# EAGLE design mouse_shield (EAGLE 5.11)
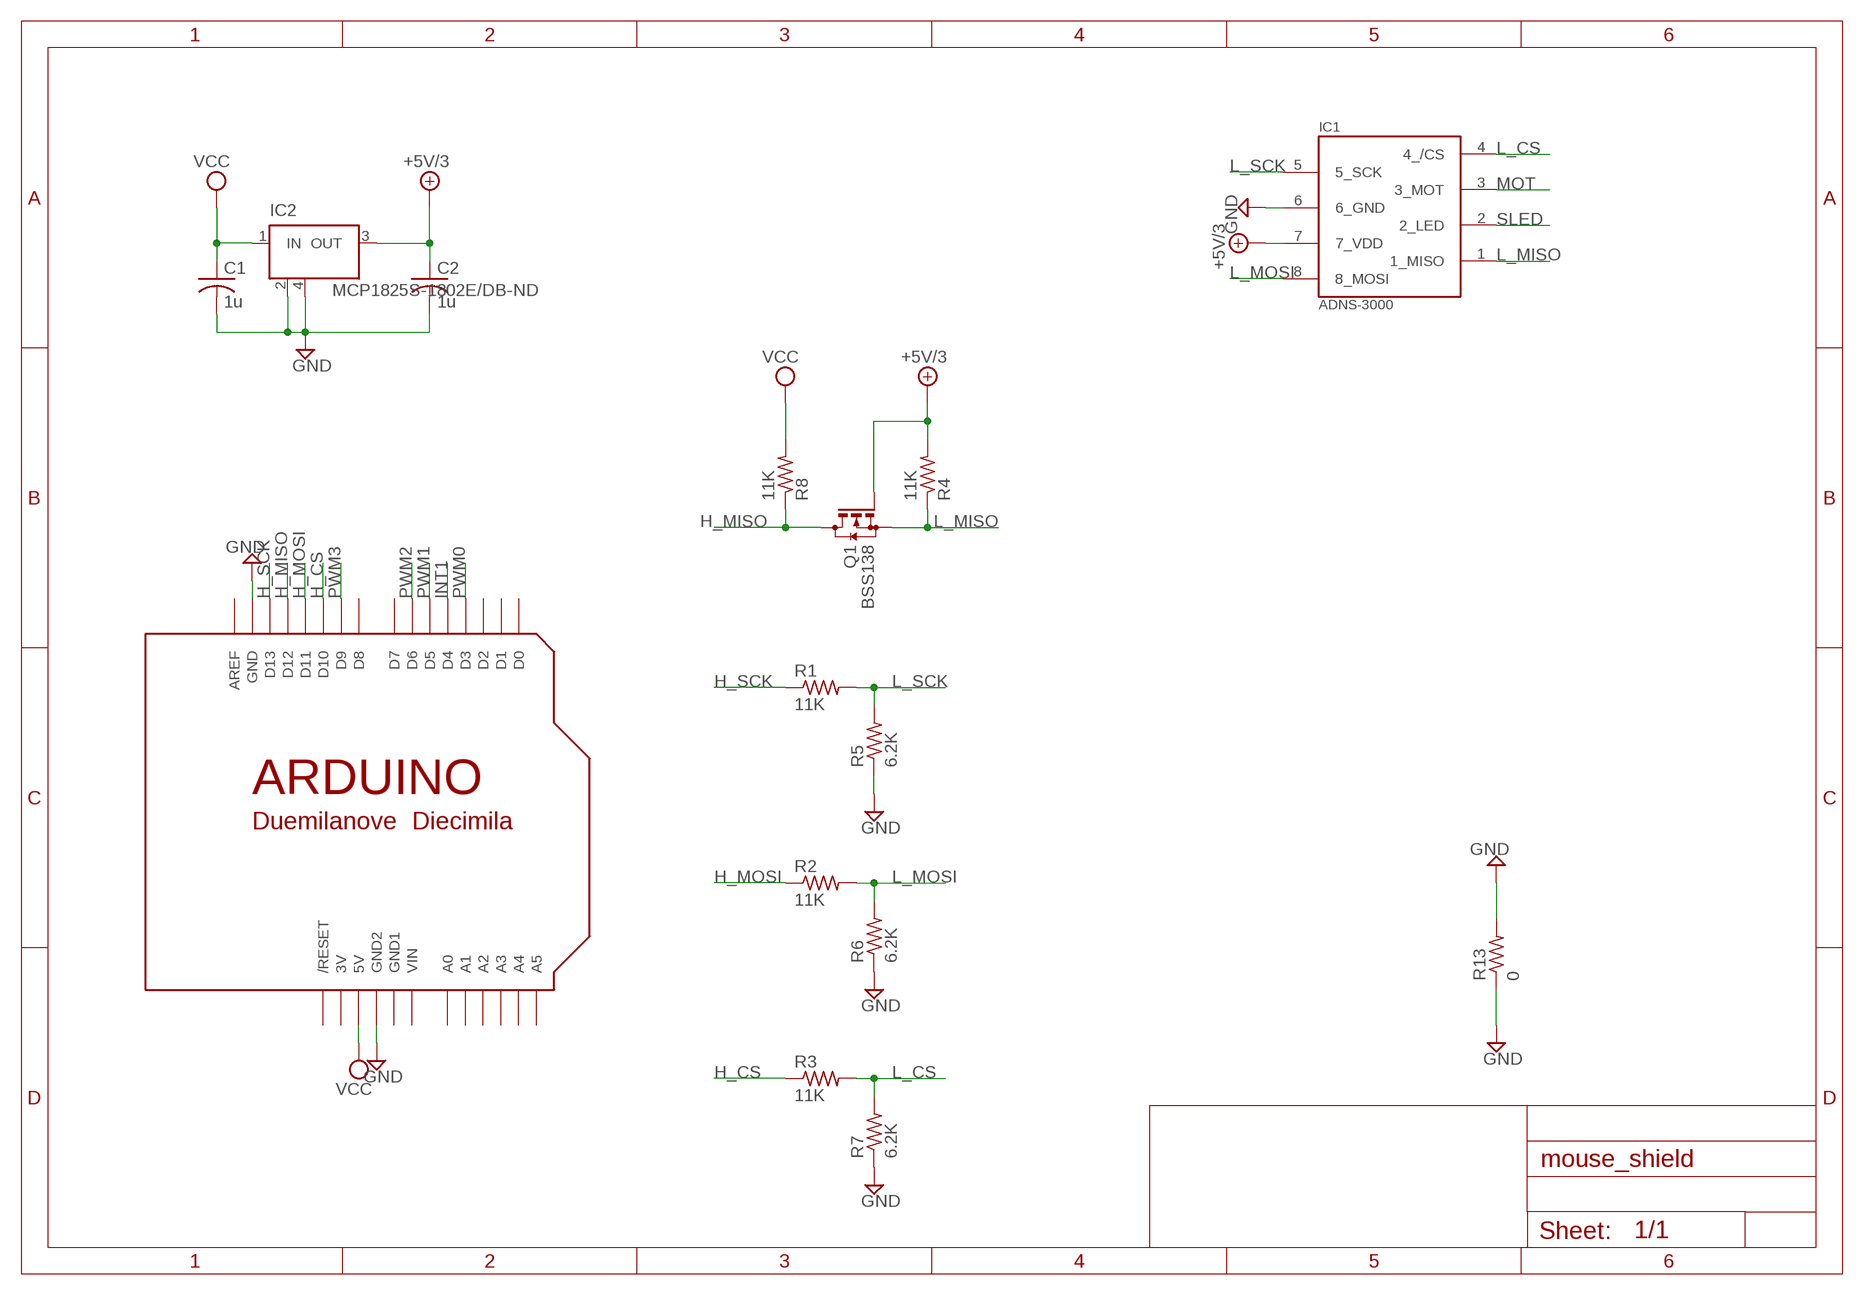
[diagram p0: schematic, sheet 1]

## Parts
C1  1u  C-USC1206  [C1206]
C2  1u  C-USC1206  [C1206]
IC1  ADNS-3000  [ADNS-3000]
IC2  MCP1825S-1802E/DB-ND  LM340S  [SOT223]
Q1  BSS138  BSS123  [SOT23]
R1  11K  R-US_R1206  [R1206]
R2  11K  R-US_R1206  [R1206]
R3  11K  R-US_R1206  [R1206]
R4  11K  R-US_R1206  [R1206]
R5  6.2K  R-US_R1206  [R1206]
R6  6.2K  R-US_R1206  [R1206]
R7  6.2K  R-US_R1206  [R1206]
R8  11K  R-US_R1206  [R1206]
R13  0  R-US_R1206  [R1206]
U$1  ARDUINO-NOHOLE  [ARDUINO-NOHOLE]

## Nets
+5V/3: C2.1 IC1.7(7_VDD) IC2.3(OUT) Q1.1(G) R4.2
GND: C1.2 C2.2 IC1.6(6_GND) IC2.2(GND) IC2.4(GND) R5.1 R6.1 R7.1 R13.1 R13.2 U$1.GND U$1.GND2
H_CS: R3.1 U$1.D10
H_MISO: Q1.3(D) R8.1 U$1.D12
H_MOSI: R2.1 U$1.D11
H_SCK: R1.1 U$1.D13
INT1: U$1.D4
L_CS: IC1.4(4_/CS) R3.2 R7.2
L_MISO: IC1.1(1_MISO) Q1.2(S) R4.1
L_MOSI: IC1.8(8_MOSI) R2.2 R6.2
L_SCK: IC1.5(5_SCK) R1.2 R5.2
MOT: IC1.3(3_MOT)
PWM0: U$1.D3
PWM1: U$1.D5
PWM2: U$1.D6
PWM3: U$1.D9
SLED: IC1.2(2_LED)
VCC: C1.1 IC2.1(IN) R8.2 U$1.5V
Unconnected: U$1.A0 U$1.A1 U$1.A2 U$1.A3 U$1.A4 U$1.A5 U$1.AREF U$1.D0 U$1.D1 U$1.D2 U$1.D7 U$1.D8 U$1.RESET(/RESET)

## Power pins joined to a net without a drawn wire
3V: U$1.3V
GND1: U$1.GND1
VIN: U$1.VIN

## Library data of the parts
C1 C2 = rcl:C-US: CAPACITOR, American symbol
IC1 = avago:ADNS-3000
IC2 = linear:LM340S: 3-Terminal Positive Regulators Source: http://cache.national.com/ds/LM/LM340.pdf
Q1 = transistor-small-signal:BSS123: N-CHANNEL MOS FET
R1-R8 R13 = rcl:R-US_: RESISTOR, American symbol
U$1 = adafruit:ARDUINO: Arduino Diecimila/Duemilanove Make a shield with ease, this package has all the named pins as well as the two mounting drill holes and an outline of the USB and DC power connector. The outline is on the DIMENSION layer, so if your board house uses it they will cut the outline to match. http://www.ladyada.net/library/pcb/eaglelibrary.html

## Board
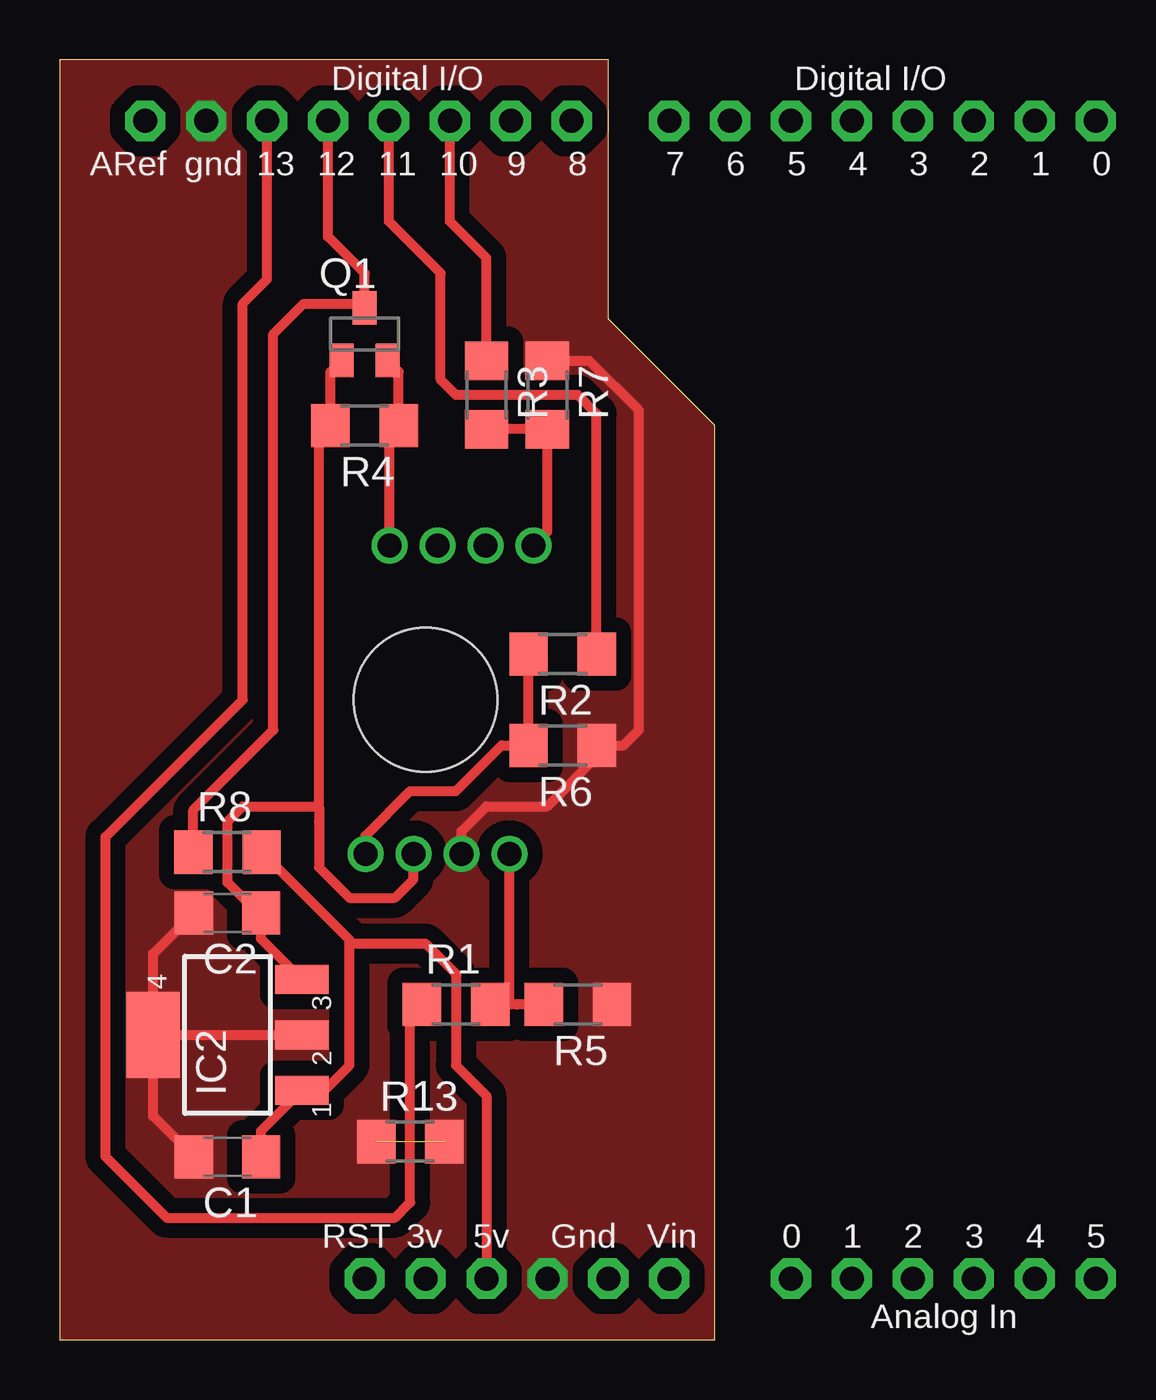
[diagram p1: board, top side]
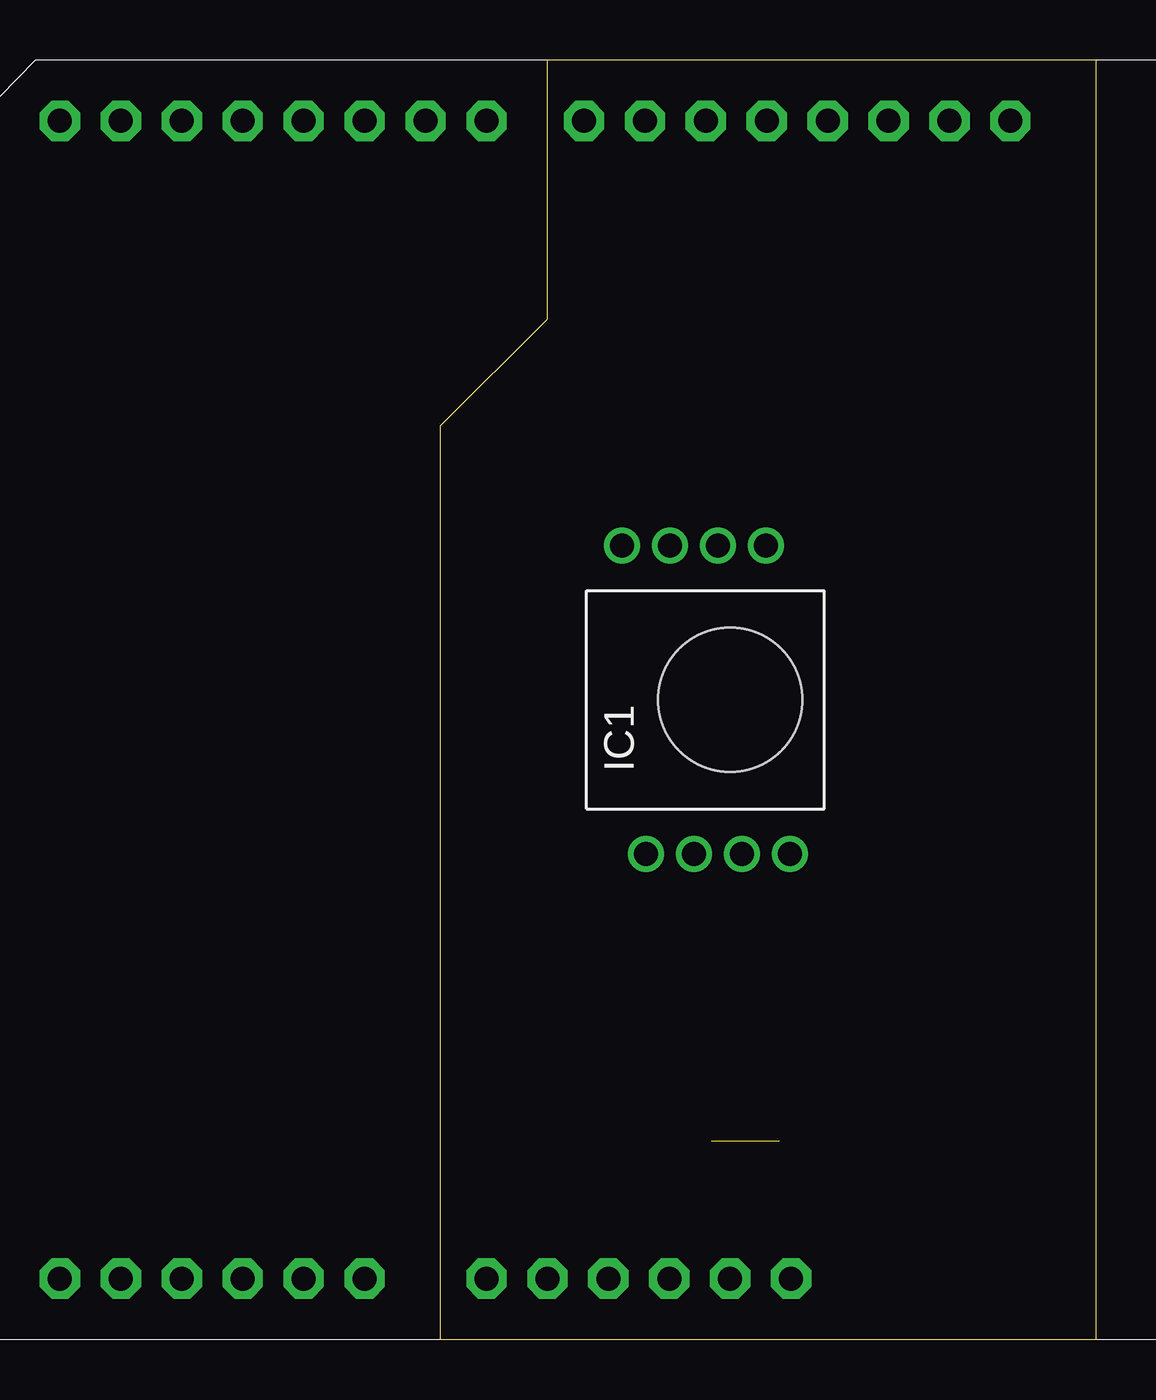
[diagram p2: board, bottom side, seen from below]

Size 27.3 x 53.34 mm. Coordinates in mm from the lower left corner, seen from the top.
Outline: 0,0 27.3,0 27.3,38.1 22.86,42.55 22.86,53.34 0,53.34 0,0
Copper layers (1*16): Top 0.035mm / dielectric 1.5mm / Bottom 0.035mm
Design rules "fab *": minimum track width 12mil, minimum drill 1mm, track to track 15.5mil, track to pad 15.5mil, pad to pad 15mil, via to via 15mil, smd to smd 10mil, copper to edge 0mil, drill to drill 1mm, minimum pad ring 0.2mm, minimum via ring 0.2mm, stop-mask expansion 4mil, vias tented up to drill 0mil, thermal gap 1mm

### Footprints (pad centres in the part's own frame; a part is rotated, then mirrored left to right if it is on the bottom)
C1206 = smd 1.6 x 1.8: 1 -1.4,0; 2 1.4,0
ADNS-3000 = drill 1 round: 1 1.5,6.425; 2 -0.5,6.425; 3 -2.5,6.425; 4 -4.5,6.425; 5 -3.5,-6.425; 6 -1.5,-6.425; 7 0.5,-6.425; 8 2.5,-6.425 | hole 6: 0,0
SOT223 = smd 1.219 x 2.235: 1 -2.311,-3.099; 2 0,-3.099; 3 2.311,-3.099 | smd 3.6 x 2.2: 4 0,3.099
SOT23 = smd 1 x 1.4: 1 -0.95,-1.1; 2 0.95,-1.1; 3 0,1.1
R1206 = smd 1.6 x 1.803: 1 -1.422,0; 2 1.422,0
ARDUINO-NOHOLE = drill 1 pad 1.676 octagon: 3V 35.56,2.54; 5V 38.1,2.54; A0 50.8,2.54; A1 53.34,2.54; A2 55.88,2.54; A3 58.42,2.54; A4 60.96,2.54; A5 63.5,2.54; AREF 23.876,50.8; D0 63.5,50.8; D1 60.96,50.8; D2 58.42,50.8; D3 55.88,50.8; D4 53.34,50.8; D5 50.8,50.8; D6 48.26,50.8; D7 45.72,50.8; D8 41.656,50.8; D9 39.116,50.8; D10 36.576,50.8; D11 34.036,50.8; D12 31.496,50.8; D13 28.956,50.8; GND 26.416,50.8; GND1 43.18,2.54; GND2 40.64,2.54; RESET 33.02,2.54; VIN 45.72,2.54

### Placement (x,y rotation side)
C1  6.98,7.62 180 top
C2  6.98,17.78 180 top
IC1  15.24,26.67 0 bottom
IC2  6.98,12.7 90 top
Q1  12.7,41.91 0 top
R1  16.51,13.97 0 top
R2  20.95,28.57 180 top
R3  17.78,39.37 270 top
R4  12.7,38.1 180 top
R5  21.59,13.97 180 top
R6  20.95,24.77 180 top
R7  20.32,39.37 270 top
R8  6.98,20.32 0 top
R13  14.6,8.26 0 top
U$1  -20.32,0 0 top

### Tracks (layer width: path | path; a pad name or v marks a point on that pad's centre or on a via)
+5V/3
  Top 0.406: Q1.1 11.28,40.34 R4.2 | IC2.3 8.38,16.71 C2.1 8.25,17.78 6.98,19.05 6.98,21.59 7.62,22.23 10.79,22.23 | R4.2 11.43,37.95 | IC1.7 14.74,19.18 13.97,18.41 12.06,18.41 10.79,19.68 10.79,21.59 10.79,22.23 | 10.79,22.23 10.79,37.62 R4.2
GND  (1 unrouted)
  Top 0.406: R7.1 22.07,40.79 24.13,38.73 24.13,25.4 23.49,24.77 R6.1 | R6.1 22.23,24.77 | IC2.4 IC2.2 | IC2.4 3.89,16.08 C2.2 | IC2.4 3.89,9.32 C1.2 | R6.1 22.23,24.61 | IC1.6 16.74,21.18 17.78,22.23 20.32,22.23 22.38,24.28 R6.1
  pour Top (isolate 0.635, no thermals): 0,53.34 22.86,53.34 22.86,42.55 27.3,38.1 27.3,0 0,0
H_CS
  Top 0.406: R3.1 17.78,45.09 16.26,46.61 U$1.D10
H_MISO
  Top 0.406: R8.1 5.56,22.07 8.89,25.4 8.89,41.91 10.16,43.18 12.53,43.18 Q1.3 12.7,44.45 11.18,45.97 U$1.D12
H_MOSI
  Top 0.406: 22.23,28.73 R2.1 22.38,38.58 21.59,39.37 16.51,39.37 15.88,40.01 15.88,44.45 13.72,46.61 U$1.D11
H_SCK
  Top 0.406: U$1.D13 8.64,44.2 7.62,43.18 7.62,26.67 1.91,20.95 1.91,7.62 4.45,5.08 13.97,5.08 14.6,5.71 14.6,13.49 R1.1
L_CS
  Top 0.406: R3.2 R7.2 20.32,33.67 IC1.4
L_MISO
  Top 0.406: Q1.2 14.12,40.34 R4.1 13.74,37.72 IC1.1
L_MOSI
  Top 0.406: R2.2 R6.2 18.41,24.77 16.51,22.86 14.6,22.86 12.74,21 IC1.8
L_SCK
  Top 0.406: R5.2 19.05,13.97 18.74,13.97 | 18.74,13.97 R1.2 | 18.74,13.97 IC1.5
VCC
  Top 0.406: C1.1 8.38,8.69 IC2.1 10.31,10.16 10.79,10.16 12.06,11.43 12.06,16.51 | R8.2 8.41,20.17 | R8.2 8.89,19.84 | 12.06,16.51 12.06,16.66 R8.2 | U$1.5V 17.78,10.16 16.51,11.43 16.51,15.24 15.24,16.51 12.06,16.51